# EAGLE design xyzzy_motor_controller_top_v1.0 (EAGLE 7.2.1)
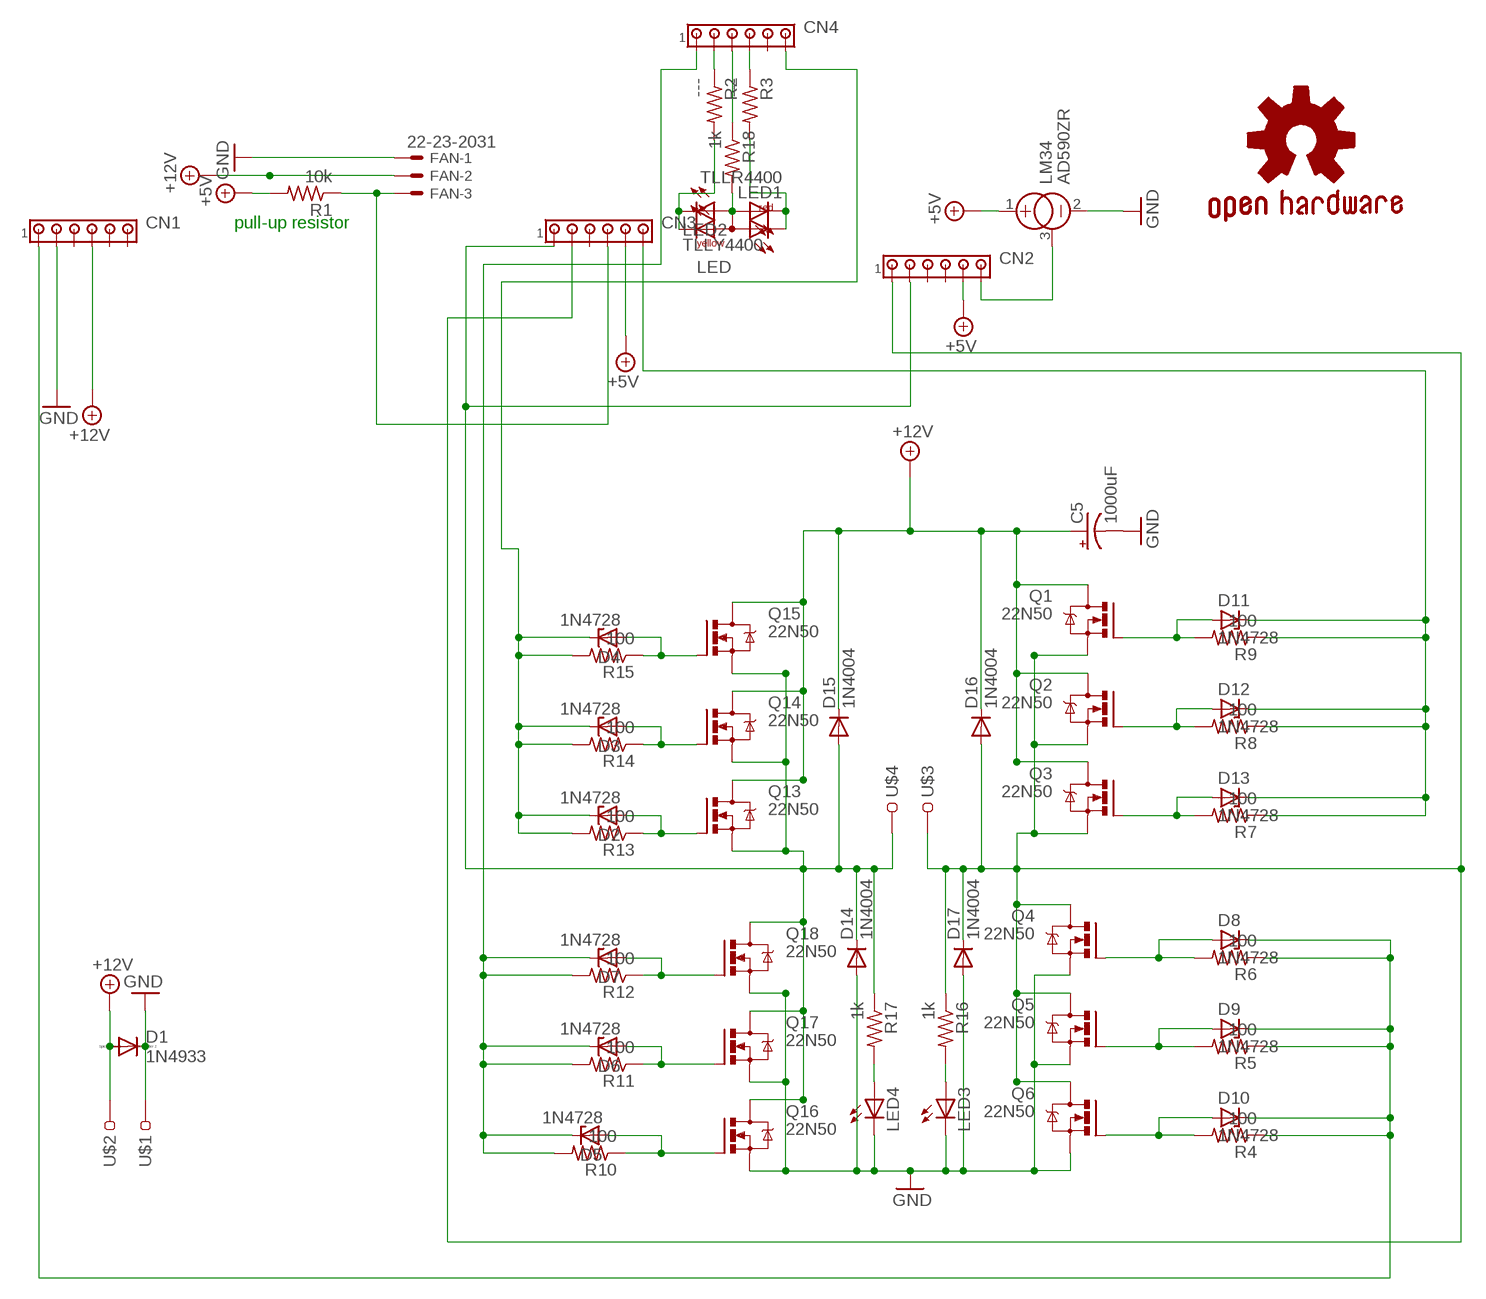
[diagram p0: schematic, sheet 1]

## Parts
C5  1000uF  CPOL-USE5-13  [E5-13]
CN1  MTA06-100  [10X06MTA]
CN2  MTA06-100  [10X06MTA]
CN3  MTA06-100  [10X06MTA]
CN4  MTA06-100  [10X06MTA]
D1  1N4933  [DO41-10]
D2  1N4728  [DO41Z10]
D3  1N4728  [DO41Z10]
D4  1N4728  [DO41Z10]
D5  1N4728  [DO41Z10]
D6  1N4728  [DO41Z10]
D7  1N4728  [DO41Z10]
D8  1N4728  [DO41Z10]
D9  1N4728  [DO41Z10]
D10  1N4728  [DO41Z10]
D11  1N4728  [DO41Z10]
D12  1N4728  [DO41Z10]
D13  1N4728  [DO41Z10]
D14  1N4004  [DO41-10]
D15  1N4004  [DO41-10]
D16  1N4004  [DO41-10]
D17  1N4004  [DO41-10]
FAN  22-23-2031  [22-23-2031]
GOLD_ORB_SM2  OSHWLOGO_GOLD_ORB_MED  [OSHW1]
LED  DUOLED-RY-A  [DUOLED-A-5MM]
LED1  TLLR4400  [LED3MM]
LED2  TLLY4400  [LED3MM]
LED3  LED3MM  [LED3MM]
LED4  LED3MM  [LED3MM]
LM34  AD590ZR  [TO92]
Q1  22N50  IRF530  [TO220BV]
Q2  22N50  IRF530  [TO220BV]
Q3  22N50  IRF530  [TO220BV]
Q4  22N50  IRF530  [TO220BV]
Q5  22N50  IRF530  [TO220BV]
Q6  22N50  IRF530  [TO220BV]
Q13  22N50  IRF530  [TO220BV]
Q14  22N50  IRF530  [TO220BV]
Q15  22N50  IRF530  [TO220BV]
Q16  22N50  IRF530  [TO220BV]
Q17  22N50  IRF530  [TO220BV]
Q18  22N50  IRF530  [TO220BV]
R1  10k  R-US_0207/12  [0207/12]
R2  ---  R-US_0207/12  [0207/12]
R3  ---  R-US_0207/12  [0207/12]
R4  100  R-US_0207/12  [0207/12]
R5  100  R-US_0207/12  [0207/12]
R6  100  R-US_0207/12  [0207/12]
R7  100  R-US_0207/12  [0207/12]
R8  100  R-US_0207/12  [0207/12]
R9  100  R-US_0207/12  [0207/12]
R10  100  R-US_0207/12  [0207/12]
R11  100  R-US_0207/12  [0207/12]
R12  100  R-US_0207/12  [0207/12]
R13  100  R-US_0207/12  [0207/12]
R14  100  R-US_0207/12  [0207/12]
R15  100  R-US_0207/12  [0207/12]
R16  1k  R-US_0207/12  [0207/12]
R17  1k  R-US_0207/12  [0207/12]
R18  1k  R-US_0207/12  [0207/12]
U$1  TAB-CON  [SPADE]
U$2  TAB-CON  [SPADE]
U$3  TAB-CON  [SPADE]
U$4  TAB-CON  [SPADE]

## Nets
+5V: CN2.5 CN3.5 LM34.1(+) R1.2
+12V: C5.+ CN1.4 D1.A D15.C D16.C FAN.2 Q1.D Q2.D Q3.D Q13.D Q14.D Q15.D U$2.P$1 U$2.P$2
GND: C5.- CN1.2 D1.C D14.A D17.A FAN.1 LED3.K(C) LED4.K(C) LM34.2(-) Q4.S Q5.S Q6.S Q16.S Q17.S Q18.S U$1.P$1 U$1.P$2
N$1: CN3.4 FAN.3 R1.1
N$2: CN2.6 LM34.3(CAN)
N$3: CN2.2 CN3.1 D14.C D15.A Q13.S Q14.S Q15.S Q16.D Q17.D Q18.D R17.1 U$4.P$1 U$4.P$2
N$5: D8.A Q4.G R6.2
N$6: LED2.K(C) LED.CX(CY) R2.2
N$7: CN4.2 R2.1
N$8: CN4.1 D5.C D6.C D7.C R10.2 R11.2 R12.2
N$9: CN3.6 D11.C D12.C D13.C R7.1 R8.1 R9.1
N$10: CN4.4 R3.1
N$11: LED1.K(C) LED.CR R3.2
N$12: LED3.A R16.2
N$13: D10.A Q6.G R4.2
N$14: D9.A Q5.G R5.2
N$15: D7.A Q18.G R12.1
N$16: CN4.6 D2.C D3.C D4.C R13.2 R14.2 R15.2
N$17: CN1.1 D8.C D9.C D10.C R4.1 R5.1 R6.1
N$18: LED4.A R17.2
N$19: D6.A Q17.G R11.1
N$20: CN2.1 CN3.2 D16.A D17.C Q1.S Q2.S Q3.S Q4.D Q5.D Q6.D R16.1 U$3.P$1 U$3.P$2
N$21: D5.A Q16.G R10.1
N$22: CN4.3 R18.1
N$23: LED1.A LED2.A LED.A R18.2
N$30: D12.A Q2.G R8.2
N$31: D11.A Q1.G R9.2
N$32: D13.A Q3.G R7.2
N$34: D3.A Q14.G R14.1
N$36: D4.A Q15.G R15.1
N$37: D2.A Q13.G R13.1
Unconnected: CN1.3 CN1.5 CN1.6 CN2.3 CN2.4 CN3.3 CN4.5

## Notes on the sheet
- pull-up resistor

## Library data of the parts
C5 = rcl:CPOL-US: POLARIZED CAPACITOR, American symbol
CN1-CN4 = con-amp:MTA06-100: AMP connector Connection corrected 2014-09-19
D1 = diode:1N4933: DIODE fast recovery rectifier, 1A
D2-D13 = diode:1N4728: Z DIODE 3.3 V, 1W, 5 percent
D14-D17 = adafruit:1N4004: DIODE General purpose 1N400x type rectifier (With bigger pads) http://www.ladyada.net/library/pcb/eaglelibrary.html
FAN = con-molex:22-23-2031: .100" (2.54mm) Center Header - 3 Pin; MF: MOLEX; MPN: 22-23-2031; OC_FARNELL: 1462950; OC_NEWARK: 30C0862
GOLD_ORB_SM2 = bfl:OSHWLOGO: These are Open-Source Hardware logos.
LED = led:DUOLED-RY-A: DUO LED 2 colors (red/yellow), 5 mm, round, common Anode www.ligitek.com or other producers.
LED1 = led:TLLR4400: Low Current (2mA) LED 3 mm Tinted Diffused Package color RED Source: Data sheet <http://www.farnell.com/datasheets/391100.pdf>; MF: VISHAY SEMICONDUCTOR; OC_FARNELL: 1612437
LED2 = led:TLLY4400: Low Current (2mA) LED 3 mm Tinted Diffused Package color YELLOW Source: Data sheet <http://www.farnell.com/datasheets/391098.pdf>; MF: VISHAY SEMICONDUCTOR; OC_FARNELL: 1612439
LED3 LED4 = led:LED: LED OSRAM: - CHIPLED LG R971, LG N971, LY N971, LG Q971, LY Q971, LO R971, LY R971 LH N974, LH R974 LS Q976, LO Q976, LY Q976 LO Q996 - Hyper CHIPLED LW Q18S LB Q993, LB Q99A, LB R99A - SideLED LS A670, LO A670, LY A670, LG A670, LP A670 LB A673, LV A673, LT A673, LW A673 LH A674 LY A675 LS A676, LA A676, LO A676, LY A676, LW A676 LS A679, LY A679, LG A679 - Hyper Micro SIDELED® LS Y876, LA Y876, LO Y876, LY Y876 LT Y87S - SmartLED LW L88C, LW L88S LB L89C, LB L89S, LG L890 LS L89K, LO L89K, LY L89K LS L896, LA L896, LO L896, LY L896 - TOPLED LS T670, LO T670, LY T670, LG T670, LP T670 LSG T670, LSP T670, LSY T670, LOP T670, LYG T670 LG T671, LOG T671, LSG T671 LB T673, LV T673, LT T673, LW T673 LH T674 LS T676, LA T676, LO T676, LY T676, LB T676, LH T676, LSB T676, LW T676 LB T67C, LV T67C, LT T67C, LS T67K, LO T67K, LY T67K, LW E67C LS E67B, LA E67B, LO E67B, LY E67B, LB E67C, LV E67C, LT E67C LW T67C LS T679, LY T679, LG T679 LS T770, LO T770, LY T770, LG T770, LP T770 LB T773, LV T773, LT T773, LW T773 LH T774 LS E675, LA E675, LY E675, LS T675 LS T776, LA T776, LO T776, LY T776, LB T776 LHGB T686 LT T68C, LB T68C - Hyper Mini TOPLED® LB M676 - Mini TOPLED Santana® LG M470 LS M47K, LO M47K, LY M47K Source: http://www.osram.convergy.de LUXEON: - LUMILED® LXK2-PW12-R00, LXK2-PW12-S00, LXK2-PW14-U00, LXK2-PW14-V00 LXK2-PM12-R00, LXK2-PM12-S00, LXK2-PM14-U00 LXK2-PE12-Q00, LXK2-PE12-R00, LXK2-PE12-S00, LXK2-PE14-T00, LXK2-PE14-U00 LXK2-PB12-K00, LXK2-PB12-L00, LXK2-PB12-M00, LXK2-PB14-N00, LXK2-PB14-P00, LXK2-PB14-Q00 LXK2-PR12-L00, LXK2-PR12-M00, LXK2-PR14-Q00, LXK2-PR14-R00 LXK2-PD12-Q00, LXK2-PD12-R00, LXK2-PD12-S00 LXK2-PH12-R00, LXK2-PH12-S00 LXK2-PL12-P00, LXK2-PL12-Q00, LXK2-PL12-R00 Source: www.luxeon.com KINGBRIGHT: KA-3528ASYC Source: www.kingbright.com
LM34 = linear:AD590ZR: TEMPERATURE SENSOR current output
Q1-Q6 Q13-Q18 = transistor-power:IRF530: HEXFET Power MOSFET
R1-R18 = adafruit:R-US_: RESISTOR, American symbol
U$1-U$4 = untitled:TAB-CON: 90 degree spade connector terminal tab. Quick Disconnect Connectors > TE Connectivity AMP Connectors 1217756-1

## Board
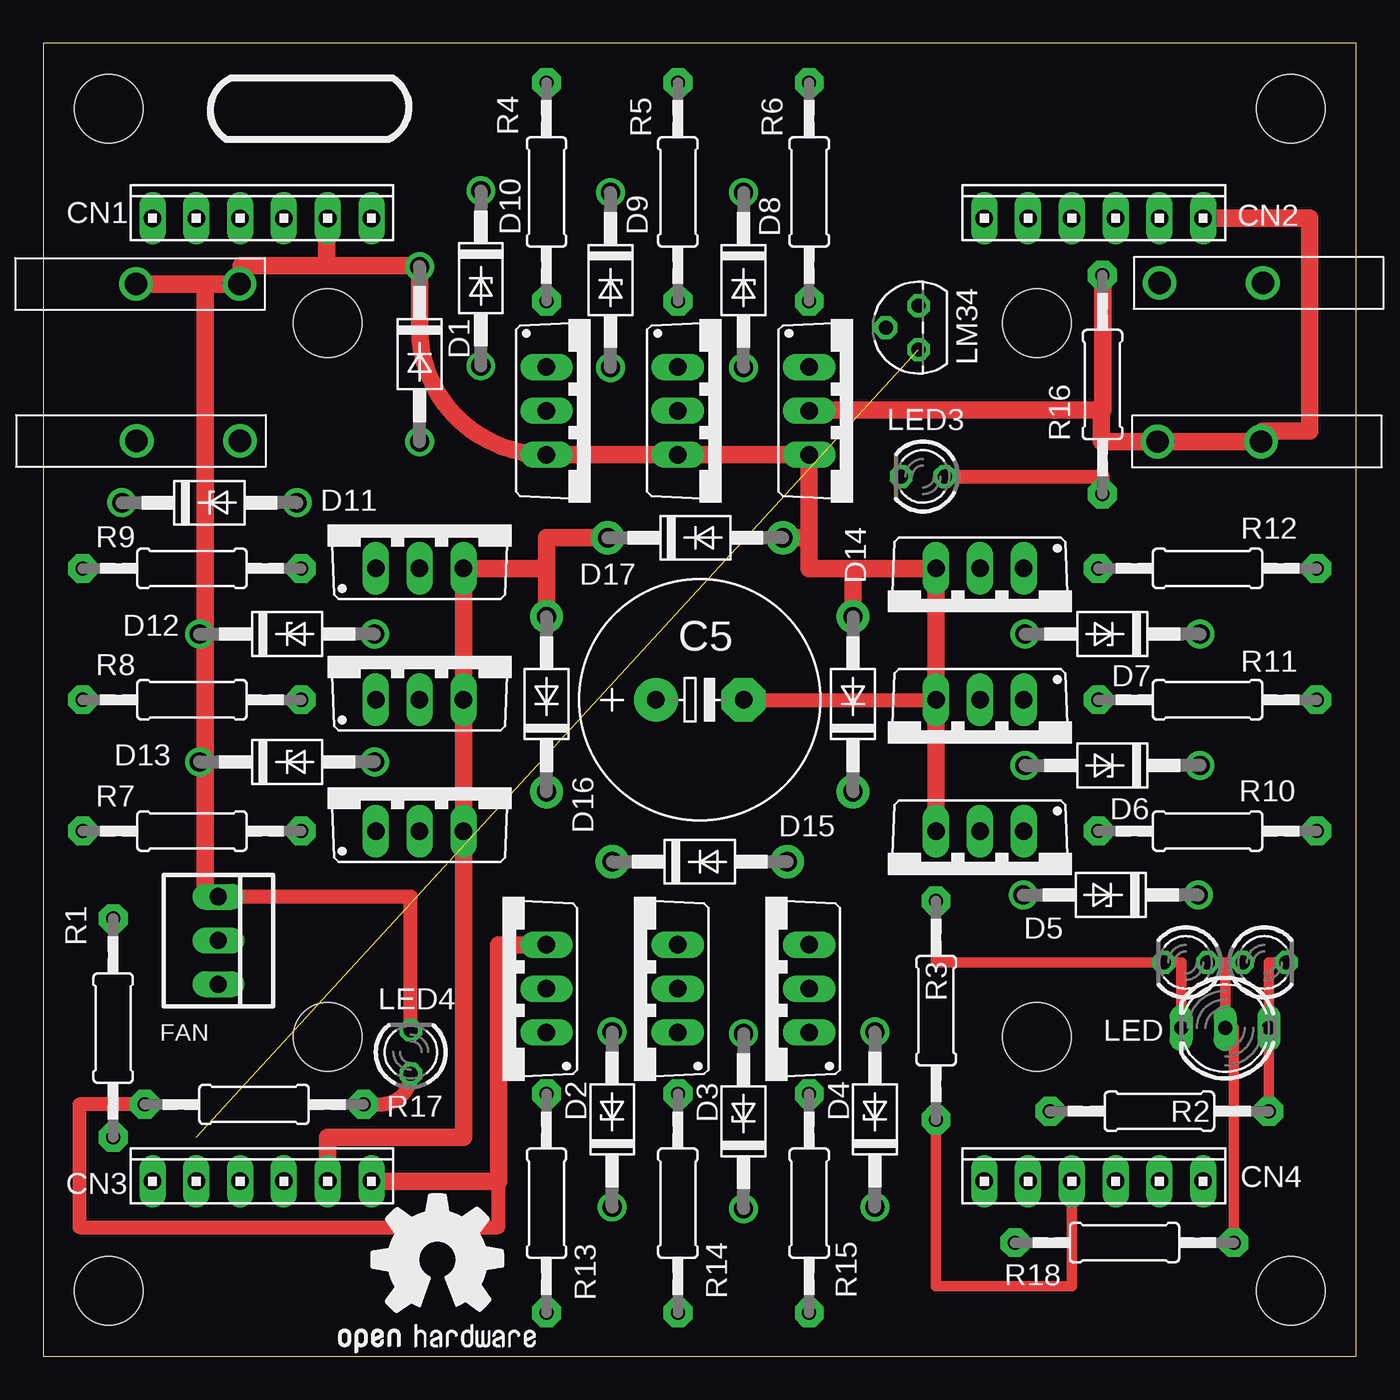
[diagram p1: board, top side]
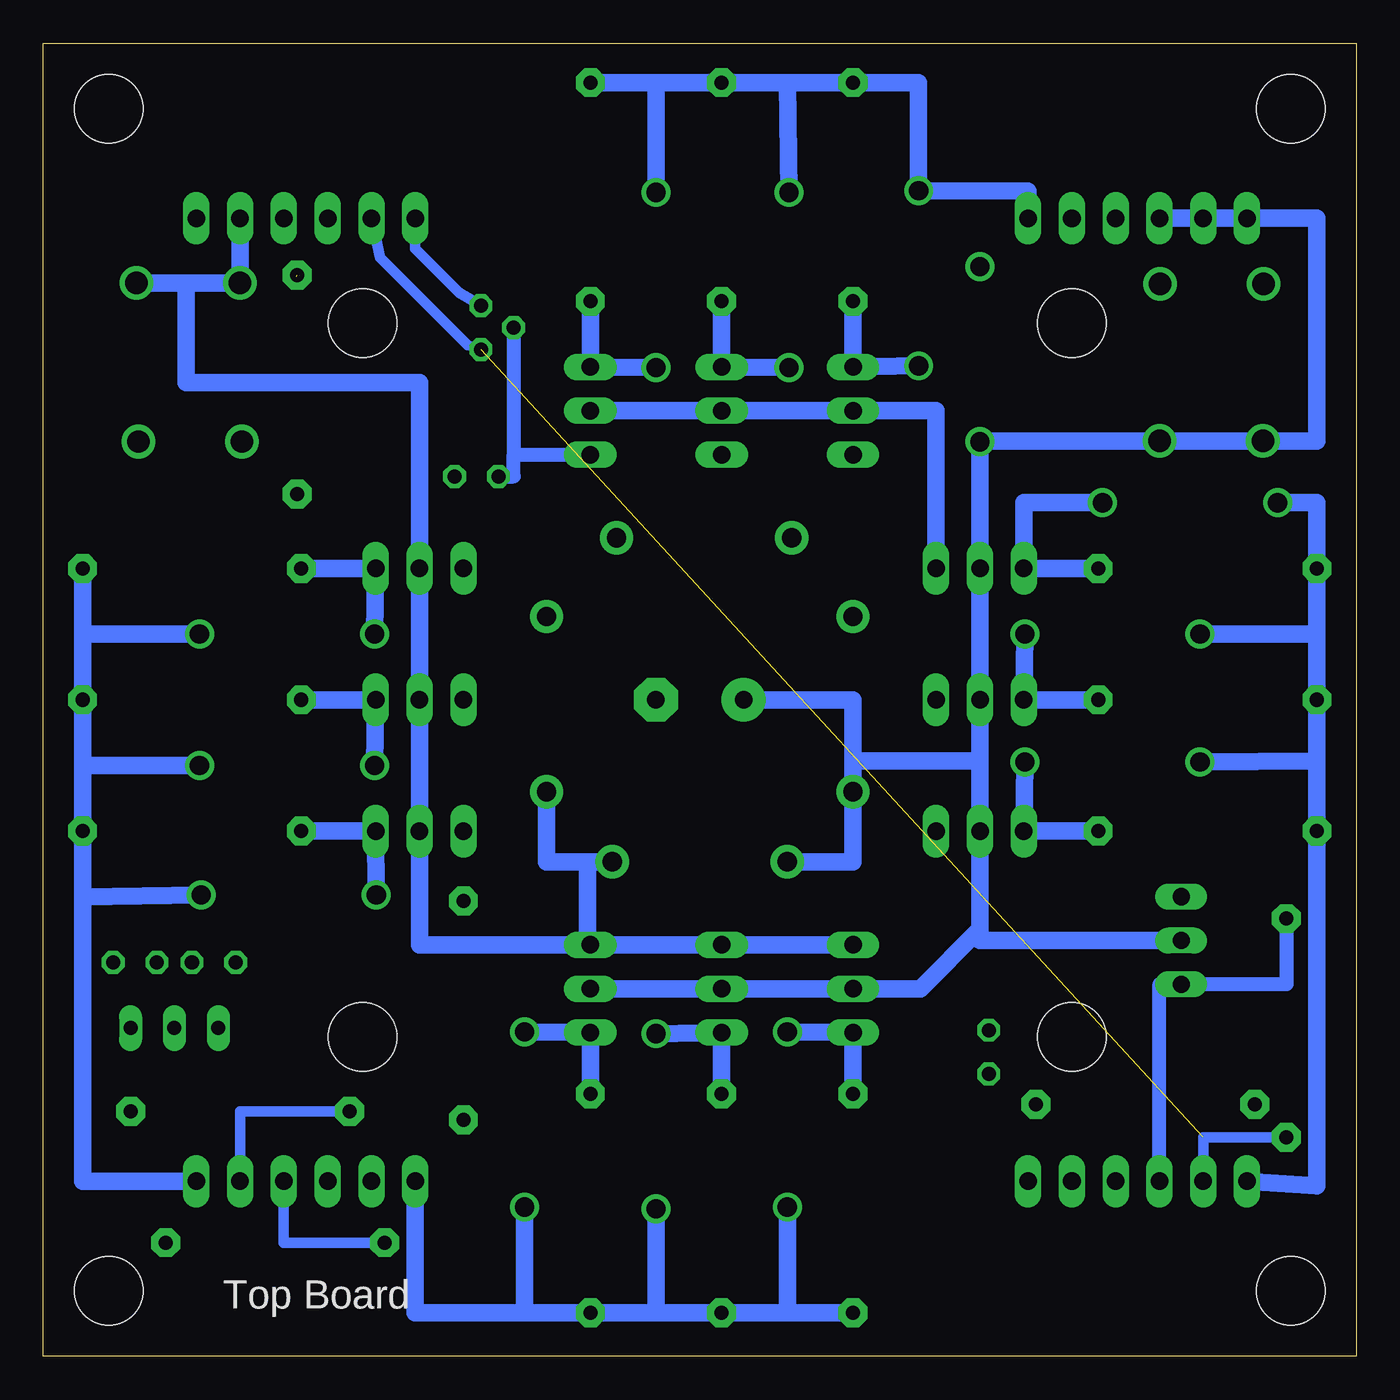
[diagram p2: board, bottom side, seen from below]

Size 76.2 x 76.2 mm. Coordinates in mm from the lower left corner, seen from the top.
Outline: 0,0 76.2,0 76.2,76.2 0,76.2 0,0
Copper layers (1*16): Top 0.035mm / dielectric 1.5mm / Bottom 0.035mm
Design rules "default": minimum track width 10mil, minimum drill 24mil, track to track 8mil, track to pad 8mil, pad to pad 8mil, via to via 8mil, smd to smd 8mil, copper to edge 40mil, drill to drill 8mil, minimum pad ring 10mil, minimum via ring 8mil, stop-mask expansion 4mil, vias tented up to drill 0mil, thermal gap 10mil
Holes 3.97 mm at 57.66,18.54 57.66,59.94 16.51,59.94 72.39,72.39 72.39,3.81 3.81,72.39 3.81,3.81 16.51,18.54

### Footprints (pad centres in the part's own frame; a part is rotated, then mirrored left to right if it is on the bottom)
E5-13 = drill 1.016 pad 2.54: + -2.54,0 | drill 1.016 pad 2.54 octagon: - 2.54,0
10X06MTA = drill 1.016 long: 1 6.35,0; 2 3.81,0; 3 1.27,0; 4 -1.27,0; 5 -3.81,0; 6 -6.35,0
DO41-10 = drill 1.118: A 5.08,0; C -5.08,0
DO41Z10 = drill 1.118: A 5.08,0; C -5.08,0
DO41-10' = drill 1.118 pad 1.93: A 5.08,0; C -5.08,0
22-23-2031 = drill 1 long: 1 -2.54,0; 2 0,0; 3 2.54,0
DUOLED-A-5MM = drill 0.813 long: A 0,0; CR 2.54,0; CX -2.54,0
LED3MM = drill 0.813 octagon: A -1.27,0; K 1.27,0
TO92 = drill 0.813 octagon: 1 -1.27,0; 2 0,1.905; 3 1.27,0
TO220BV = drill 1.016 long: D 0,-2.54; G -2.54,-2.54; S 2.54,-2.54
0207/12 = drill 0.813 pad 1.676 octagon: 1 -6.35,0; 2 6.35,0
SPADE = drill 1.3: P$1 3,0; P$2 -3,0

### Placement (x,y rotation side)
C5  38.1,38.1 0 top
CN1  12.7,66.04 0 top
CN2  60.96,66.04 0 top
CN3  12.7,10.16 0 top
CN4  60.96,10.16 0 top
D1  21.84,58.15 270 top
D2  33.02,13.75 90 top
D3  40.64,13.65 90 top
D4  48.26,13.75 90 top
D5  61.95,26.77 180 top
D6  62.05,34.29 180 top
D7  62.05,41.91 180 top
D8  40.64,62.45 270 top
D9  32.92,62.45 270 top
D10  25.4,62.55 270 top
D11  9.65,49.53 0 top
D12  14.15,41.91 0 top
D13  14.15,34.49 0 top
D14  1N4004  [DO41-10']  46.99,37.85 90 top
D15  1N4004  [DO41-10']  38.1,28.7 0 top
D16  1N4004  [DO41-10']  29.21,37.85 90 top
D17  1N4004  [DO41-10']  37.85,47.5 0 top
FAN  10.16,24.13 270 top
GOLD_ORB_SM2  16.51,-1.52 0 top
LED  68.58,19.05 180 top
LED1  66.29,22.86 180 top
LED2  70.87,22.86 0 top
LED3  51.05,51.05 180 top
LED4  21.34,17.66 90 top
LM34  50.8,59.69 90 top
Q1  21.84,48.26 0 top
Q2  21.84,40.64 0 top
Q3  21.84,33.02 0 top
Q4  46.99,54.86 270 top
Q5  39.37,54.86 270 top
Q6  31.75,54.86 270 top
Q13  26.67,21.34 90 top
Q14  34.29,21.34 90 top
Q15  41.91,21.34 90 top
Q16  54.36,27.94 180 top
Q17  54.36,35.56 180 top
Q18  54.36,43.18 180 top
R1  4.06,19.05 270 top
R2  64.77,14.22 0 top
R3  51.82,20.07 90 top
R4  29.21,67.56 270 top
R5  36.83,67.56 270 top
R6  44.45,67.56 270 top
R7  8.64,30.48 0 top
R8  8.64,38.1 0 top
R9  8.64,45.72 0 top
R10  67.56,30.48 0 top
R11  67.56,38.1 0 top
R12  67.56,45.72 0 top
R13  29.21,8.89 270 top
R14  36.83,8.89 270 top
R15  44.45,8.89 270 top
R16  61.47,56.39 270 top
R17  12.24,14.62 0 top
R18  62.74,6.6 0 top
U$1  8.38,62.22 180 top
U$2  8.43,53.12 180 top
U$3  67.67,53.08 0 top
U$4  67.77,62.28 0 top

### Tracks (layer width: path | path; a pad name or v marks a point on that pad's centre or on a via)
+5V  (1 unrouted)
  Bottom 0.61: LM34.1 51.56,58.67 56.64,63.75 CN2.5 | CN3.5 8.89,12.7 R1.2
+12V
  Bottom 1.016: Q15.D Q14.D Q13.D 25.31,21.34 21.84,24.8 | 21.84,34.54 Q3.D 21.84,24.8 | 21.84,34.54 Q2.D Q1.D D1.A 21.84,53.12 U$2.P$2 6,53.12 | FAN.2 21.84,24.13 21.84,24.8 | D15.C 29.21,28.7 D16.C 29.21,34.54 | C5.+ 29.21,38.1 29.21,34.54 | 29.21,34.54 21.84,34.54 | U$2.P$1 6,53.12 | CN1.4 2.3,66.04 2.3,53.1 6,53.1 6,53.12
GND
  Top 0.813: C5.- Q17.S | LED4.K 21.34,26.67 FAN.1
  Top 1.016: 16.41,63.3 CN1.2 | 21,63.3 D1.C 21.84,59.69 arc90 Q6.S Q5.S Q4.S 44.45,47.5 | Q16.S Q17.S Q18.S 46.99,45.72 | 46.99,45.72 44.45,45.72 44.45,47.5 | D17.A 44.45,47.5 | D14.A 46.99,45.72 | U$1.P$1 9.4,62.22 | 9.4,62.22 U$1.P$2 11.5,62.12 11.5,63.3 16.41,63.3 | 16.41,63.3 21,63.3 | 21.1,63.3 21,63.3 | FAN.1 9.4,26.67 9.4,62.22
  Bottom 0.813: LM34.2 48.9,52.32 | 48.9,52.32 Q4.S | LED3.K 48.9,51.05 48.9,52.32
N$1
  Bottom 0.813: R1.1 4.06,21.59 FAN.3 11.43,21.59 CN3.4
N$2
  Bottom 0.61: LM34.3 52.07,61.72 54.61,64.26 CN2.6
N$3
  Top 0.813: R17.1 2.1,14.62 2.1,7.5 26.42,7.5 26.42,10.7
  Top 1.016: Q13.S 26.42,23.88 26.42,10.7 26.42,10.16 CN3.1
  Bottom 1.016: Q13.S Q14.S Q15.S | Q15.S 54.36,23.88 Q16.D Q17.D Q18.D 54.36,56.5 67.9,56.5 67.9,62.28 | D14.C 46.99,28.7 44.6,28.7 | 44.6,28.7 D15.A | U$4.P$1 67.9,62.28 | 67.9,62.28 U$4.P$2 CN2.2 | Q15.S 44.6,23.88 44.6,28.7
N$5
  Bottom 1.016: R6.2 Q4.G D8.A
N$6
  Top 0.61: R2.2 LED.CX 71.12,22.86 LED2.K
N$7
  Bottom 0.61: R2.1 64.77,14.22 CN4.2
N$8
  Bottom 1.016: 73.91,41.91 R12.2 | 73.91,41.91 D7.C | 73.91,34.29 R11.2 73.91,41.91 | 73.91,34.29 D6.C | 73.91,26.67 R10.2 73.91,34.29 | 73.91,26.67 D5.C | 73.91,26.67 73.91,10.16 CN4.1
N$9
  Bottom 1.016: D11.C 2.29,49.53 R9.1 2.29,41.91 | 2.29,41.91 D12.C | 2.29,41.91 R8.1 2.29,34.54 | 2.29,34.54 D13.C | 2.29,34.54 R7.1 2.29,9.91 CN3.6
N$10
  Top 0.61: R3.1 51.82,4.06 59.69,4.06 CN4.4
N$11
  Top 0.61: LED.CR 66.04,22.86 LED1.K 51.82,22.86 R3.2
N$12
  Top 0.813: LED3.A 61.47,51.05 R16.2
N$13
  Bottom 1.016: R4.2 Q6.G D10.A
N$14
  Bottom 1.016: R5.2 Q5.G D9.A
N$15
  Bottom 1.016: R12.1 Q18.G D7.A
N$16
  Bottom 1.016: 48.26,2.54 D4.C | 48.26,2.54 54.61,2.54 CN4.6 | 48.26,2.54 R15.2 40.64,2.54 | 40.64,2.54 D3.C | 40.64,2.54 R14.2 33.02,2.54 | 33.02,2.54 D2.C | R13.2 33.02,2.54
N$17
  Bottom 1.016: 40.64,73.91 R6.1 | 40.64,73.91 D8.C | 40.64,73.91 R5.1 33.02,73.91 | 33.02,73.91 D9.C | 33.02,73.91 R4.1 25.4,73.91 D10.C 19.05,67.6 CN1.1
N$18
  Top 0.813: R17.2 19.57,14.62 arc90 LED4.A
N$19
  Bottom 1.016: R11.1 Q17.G D6.A
N$20  (1 unrouted)
  Top 1.016: CN3.2 16.51,12.7 24.38,12.7 Q3.S Q2.S Q1.S 29.21,45.72 | D17.C 29.21,47.5 29.21,45.72 | 29.21,45.72 D16.A | 61.4,54.9 61.4,53.08 U$3.P$2 U$3.P$1 70.77,53.7 73.5,53.7 73.5,66.04 CN2.1 | 61.4,54.9 61.5,54.9 61.5,62.64 | 61.4,54.9 44.45,54.9 Q4.D
  Bottom 1.016: Q4.D Q5.D Q6.D 24.38,54.86 Q1.S
N$21
  Bottom 1.016: D5.A Q16.G R10.1
N$22
  Bottom 0.61: R18.1 62.23,6.6 CN4.3
N$23
  Top 0.61: LED1.A 68.58,22.86 | 68.58,22.86 LED2.A | 68.58,22.86 LED.A 69.09,19.05 R18.2
N$30
  Bottom 1.016: R8.2 Q2.G D12.A
N$31
  Bottom 1.016: R9.2 Q1.G 19.3,49.53 D11.A
N$32
  Bottom 1.016: D13.A Q3.G R7.2
N$34
  Bottom 1.016: R14.1 Q14.G D3.A
N$36
  Bottom 1.016: D4.A Q15.G R15.1
N$37
  Bottom 1.016: R13.1 Q13.G D2.A

### Text on the board
bNames: Top Board
tValues: XYZZY | BioLumo | Motor Controller | Prototype v1.0 | GND | Motor | +12v | GND | +12v | Inspired by IFI Victor 884